# Altium schematic sheet powersupply.SchDoc: Linda 50 - Power Suply
size A4; Author: Eduardo Marques; Organization: Linda Hand Build Amplifiers
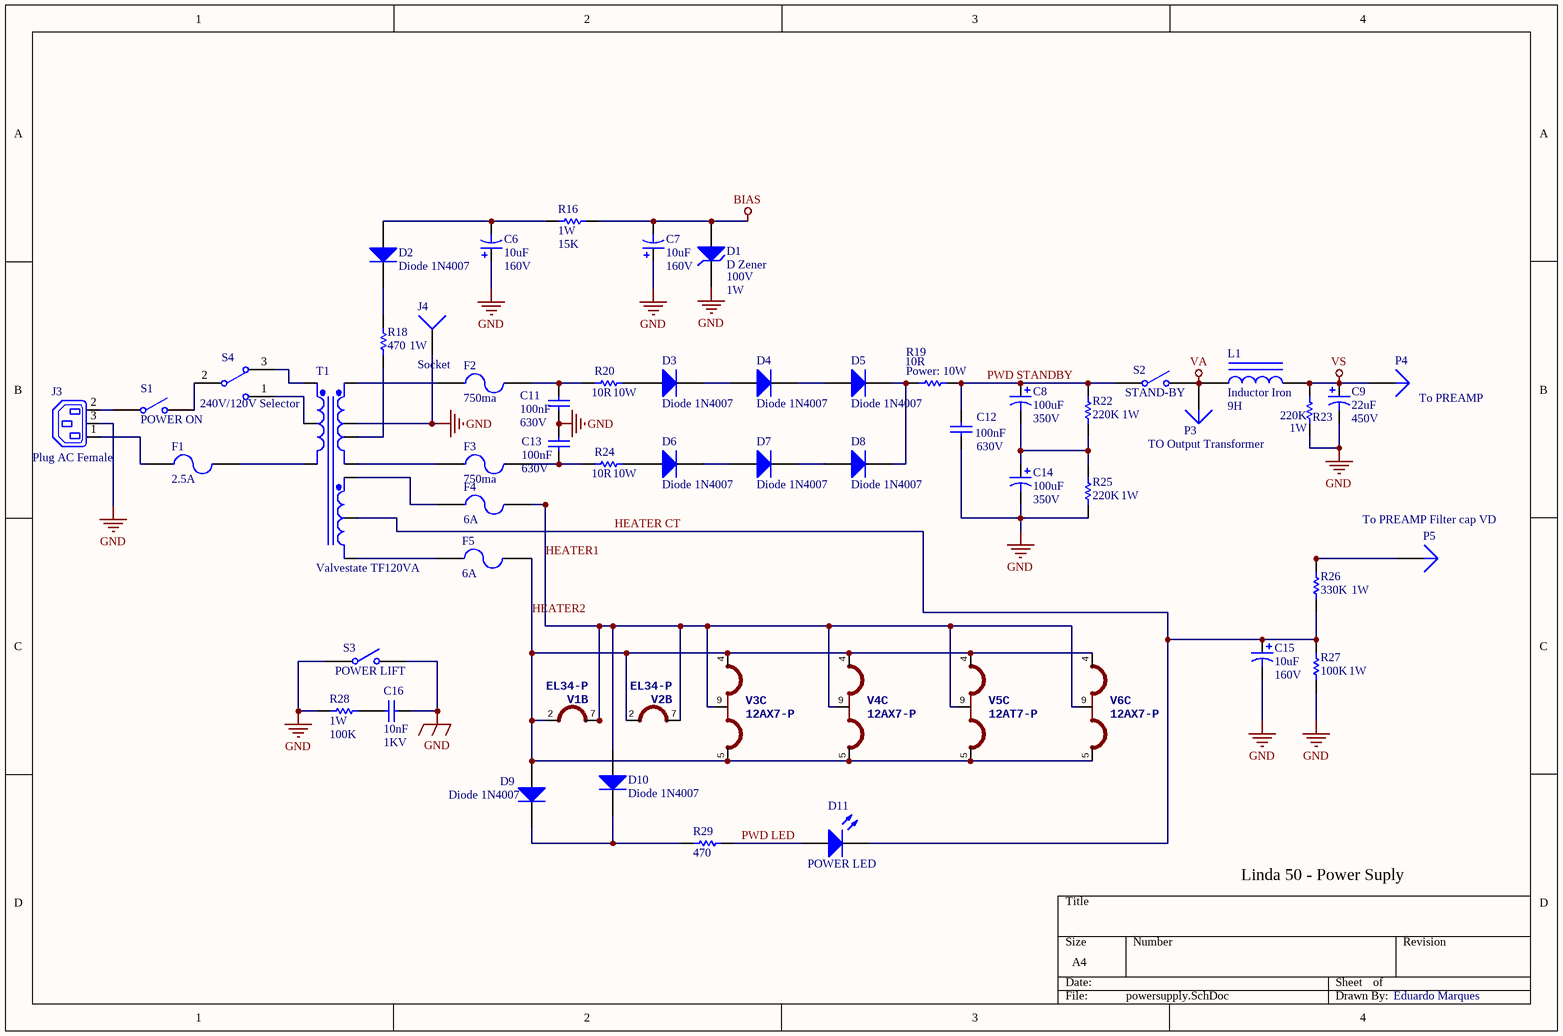
[diagram p0: powersupply.SchDoc]

## Parts
C6  value 10uF  Voltage: 160V  [RAD-POL-16x20x7.5]  (hidden comment: Cap Pol Radial Vishay 22uF 100V)
C7  value 10uF  Voltage: 160V  [RAD-POL-16x20x7.5]  (hidden comment: Cap Pol Radial Vishay 22uF 100V)
C8  value 100uF  Voltage: 350V  [FT Eletrolitic 100uF Axial]  (hidden comment: Cap FT Eletrolitic 100uF Axial 350V)
C9  value 22uF  Voltage: 450V  [RAD-POL-7.6-15]  (hidden comment: Cap Pol Rad)
C11  value 100nF  Voltage: 630V  [CAP-XICON-100nF-630V]  (hidden comment: Orange Drop Capacitor)
C12  value 100nF  Voltage: 630V  [CAP-XICON-100nF-630V]  (hidden comment: Orange Drop Capacitor)
C13  value 100nF  Voltage: 630V  [CAP-XICON-100nF-630V]  (hidden comment: Orange Drop Capacitor)
C14  value 100uF  Voltage: 350V  [FT Eletrolitic 100uF Axial]  (hidden comment: Cap FT Eletrolitic 100uF Axial 350V)
C15  value 10uF  Voltage: 160V  [RAD-POL-16x20x7.5]  (hidden comment: Cap Pol Radial Vishay 22uF 100V)
C16  value 10nF  Voltage: 1KV  [RAD-0.4]  (hidden comment: Orange Drop Capacitor)
D1  D Zener  Voltage: 100V  Power: 1W  [ZENER 1W 100V]
D2  Diode 1N4007  [1N4007-10.46mm Diode]
D3  Diode 1N4007  [1N4007-10.46mm Diode]
D4  Diode 1N4007  [1N4007-10.46mm Diode]
D5  Diode 1N4007  [1N4007-10.46mm Diode]
D6  Diode 1N4007  [1N4007-10.46mm Diode]
D7  Diode 1N4007  [1N4007-10.46mm Diode]
D8  Diode 1N4007  [1N4007-10.46mm Diode]
D9  Diode 1N4007  [1N4007-10.46mm Diode]
D10  Diode 1N4007  [1N4007-10.46mm Diode]
D11  POWER LED  [LED-1]
F1  2.5A  [PIN-W2/E2.8]
F2  750ma  [FUSE-PCB-6x31]
F3  750ma  [FUSE-PCB-6x31]
F4  6A  [FUSE-PCB-6x31]
F5  6A  [FUSE-PCB-6x31]
J3  Plug AC Female  [IEC7-2H3]
J4  Socket  [PIN1]
L1  Inductor Iron  value 9H  [AXIAL-0.9]
P3  TO Output Transformer  [PIN1]
P4  To PREAMP  [PIN1]
P5  To PREAMP Filter cap VD  [PIN1]
R16  value 15K  Power: 1W  [AXIAL-0.6]  (hidden comment: Metal Film Resistor 1W)
R18  value 470  Power: 1W  [AXIAL-0.6]  (hidden comment: Metal Film Resistor 1W)
R19  value 10R  Power: 10W  [Power Wirewound Resistor 10W - Vishay Dale]  (hidden comment: Wire Wound Power Resistor)
R20  value 10R  Power: 10W  [Power Wirewound Resistor 10W - Vishay Dale]  (hidden comment: Wire Wound Power Resistor)
R22  value 220K  Power: 1W  [RESISTOR-MetalOxide-3W]  (hidden comment: Metal Film Resistor 1W)
R23  value 220K  Power: 1W  [AXIAL-0.6]  (hidden comment: Metal Film Resistor 1W)
R24  value 10R  Power: 10W  [Power Wirewound Resistor 10W - Vishay Dale]  (hidden comment: Wire Wound Power Resistor)
R25  value 220K  Power: 1W  [RESISTOR-MetalOxide-3W]  (hidden comment: Metal Film Resistor 1W)
R26  value 330K  Power: 1W  [AXIAL-0.6]  (hidden comment: Metal Film Resistor 1W)
R27  value 100K  Power: 1W  [AXIAL-0.6]  (hidden comment: Metal Film Resistor 1W)
R28  value 100K  Power: 1W  [AXIAL-0.6]  (hidden comment: Metal Film Resistor 1W)
R29  value 470  [AXIAL-0.6]  (hidden comment: Metal Film Resistor 1/2W)
S1  POWER ON  [SPST-2]
S2  STAND-BY  [SPST-2]
S3  POWER LIFT  [SPST-2]
S4  240V/120V Selector  [SPDT]
T1  Valvestate TF120VA  [TRF_5]
V1  EL34-P  [OKTAL]  (part B of 2)
V2  EL34-P  [OKTAL]  (part B of 2)
V3  12AX7-P  [NOVAL]  (part C of 3)
V4  12AX7-P  [NOVAL]  (part C of 3)
V5  12AT7-P  [NOVAL]  (part C of 3)
V6  12AX7-P  [NOVAL]  (part C of 3)

## Nets
BIAS: C7.2 D1.1(A) R16.1
GND: C6.1 C7.1 C9.2 C11.1 C12.1 C13.2 C14.2 C15.2 C16.1 D1.2(K) J3.3(E) J4.1 R23.1 R25.1 R27.1 R28.2 S3.1(COMMON) S3.2(NO) T1.5(SEC_CT)
VA: L1.1 P3.1 S2.2(NO)
VS: C9.1 L1.2 P4.1 R23.2
HEATER1: D10.1(A) F4.2 V1.7(H2) V2.7(H2) V3.9(H2) V4.9(H2) V5.9(H2) V6.9(H2)
HEATER2: D9.1(A) F5.2 V1.2(H1) V2.2(H1) V3.4(H1) V3.5(H3) V4.4(H1) V4.5(H3) V5.4(H1) V5.5(H3) V6.4(H1) V6.5(H3)
HEATER CT: C15.1 D11.2(K) R26.1 R27.2 T1.9(3.15V_CT)
PWD LED: D11.1(A) R29.2
PWD STANDBY: C8.1 C12.2 R19.2 R22.2 S2.1(COMMON)
NetC6_2: C6.2 D2.1(A) R16.2
NetC8_2: C8.2 C14.1 R22.1 R25.2
NetC11_2: C11.2 F2.2 R20.1
NetC13_1: C13.1 F3.2 R24.1
NetC16_2: C16.2 R28.1
NetD2_2: D2.2(K) R18.2
NetD3_1: D3.1(A) R20.2
NetD3_2: D3.2(K) D4.1(A)
NetD4_2: D4.2(K) D5.1(A)
NetD5_2: D5.2(K) D8.2(K) R19.1
NetD6_1: D6.1(A) R24.2
NetD6_2: D6.2(K) D7.1(A)
NetD7_2: D7.2(K) D8.1(A)
NetD9_2: D9.2(K) D10.2(K) R29.1
NetF1_1: F1.1 J3.1(L)
NetF1_2: F1.2 T1.3(Pri-)
NetF2_1: F2.1 T1.4(Sec_355V_+)
NetF3_1: F3.1 T1.7(Sec_355V_-)
NetF4_1: F4.1 T1.8(3.15V+)
NetF5_1: F5.1 T1.10(3.15V_-)
NetJ3_2: J3.2(N) S1.1(COMMON)
NetP5_1: P5.1 R26.2
NetR18_1: R18.1 T1.6(Sec_55V_+)
NetS1_2: S1.2(NO) S4.2
NetS4_1: S4.1 T1.2(Pri+_127V)
NetS4_3: S4.3 T1.1(Pri+220V)

## Library data of the parts
C6 C7 C15 = Cap Pol Radial Vishay 22uF 100V: Vishay 22uF 100V Polarized Capacitor (Radial); 2 Leads; Part Number: 142 RHS; Published: 8-Jun-2000; LatestRevisionDate: 17-Jul-2002; LatestRevisionNote: Re-released for DXP Platform.; PackageReference: POLAR0.8; Publisher: Altium Limited; PackageDescription: Polarized Capacitor; 2 Leads
C8 C14 = Cap FT Eletrolitic 100uF Axial 350V: FT Eletrolitic Polarized Capacitor Axial 100uF; Published: 8-Jun-2000; LatestRevisionDate: 12-Feb-2014; LatestRevisionNote: Re-released for DXP Platform.; PackageReference: POLAR0.8; Publisher: Whitesheep Amps; PackageDescription: Polarized Capacitor; 2 Leads
C9 = Cap Pol Rad: Polarized Capacitor (Axial); Published: 8-Jun-2000; LatestRevisionDate: 17-Jul-2002; LatestRevisionNote: Re-released for DXP Platform.; PackageReference: POLAR0.8; Publisher: Altium Limited; PackageDescription: Polarized Capacitor; 2 Leads
C11-C13 C16 = Cap-XICON-100nF-630V: Capacitor XICON (WINE COVER) Polypropilene CAP 630V; Published: 8-Jun-2000; LatestRevisionDate: 17-Jul-2002; LatestRevisionNote: Re-released for DXP Platform.; PackageReference: RAD-0.3; Publisher: Altium Limited; PackageDescription: Radial Cap, Thru-Hole; 2 Leads; 0.3 in Pin Spacing
D1 = D Zener: Zener Diode; Model: 1N4764A; Builder: Vishay; Published: 8-Jun-2000; LatestRevisionDate: 17-Jul-2002; LatestRevisionNote: Re-released for DXP Platform.; PackageReference: DIODE-0.7; Publisher: Altium Limited; PackageDescription: Diode, Thru-Hole; 2 Leads; 0.7 in Pin Spacing
D2-D10 = Diode 1N4007: 1 Amp General Purpose Rectifier; Published: 8-Jun-2000; LatestRevisionDate: 17-Jul-2002; LatestRevisionNote: Re-released for DXP Platform.; DatasheetVersion: 1998; PackageVersion: Aug-1999; PackageReference: DO-41; Publisher: Altium Limited; PackageDescription: Diode, Axial; Body 5.2 x 2.7 mm (LxDia. max), Lead Dia. 0.86 mm (max); Code_JEDEC: DO-204-AL; ComponentLink1Description: Manufacturer Link; ComponentLink1URL: http://www.fairchildsemi.com/; ComponentLink2Description: Datasheet; ComponentLink2URL: http://www.fairchildsemi.com/ds/1N%2F1N4001.pdf
D11 = LED1: Typical RED GaAs LED; Published: 8-Jun-2000; LatestRevisionDate: 08-Jul-2005; LatestRevisionNote: Mech Layer 1 removed.; PackageReference: LED-1; Publisher: Altium Limited; PackageDescription: LED; 2 Leads
F1-F5 = Fuse 2: Fuse; Published: 8-Jun-2000; LatestRevisionDate: 17-Jul-2002; LatestRevisionNote: Re-released for DXP Platform.; PackageReference: PIN-W2/E2.8; Publisher: Altium Limited; PackageDescription: Thru-Hole; 2 Leads
J3 = Plug AC Female: IEC Mains Power Outlet, EN60 320-2-2 F Class I, PC Flange Rear Mount, Chassis Socket; PackageDocument: ver.80, 15-Sep-2003; MaximumRating: 10A, 250V a.c. (UL & CSA 15A, 250V a.c.); MountingFixtures: Not drawn on schematic symbol.; PCB_Layout: Complies with manufacturer's recommendation.; DrillSize: Corresponds to nominal value.; Published: 15-Jul-2004; LatestRevisionDate: 15-Jul-2004; LatestRevisionNote: Component Replaced & renamed from "Phonejack".; DatasheetDocument: ver.80, 15-Sep-2003; PackageReference: PX0675/PC; Publisher: Altium Limited; Terminations: P.C. Spills; ComponentLink1Description: Manufacturer Link; ComponentLink1URL: http://www.bulgin.co.uk/
L1 = Inductor Iron: Magnetic-Core Inductor; Published: 24-Mar-1999; LatestRevisionDate: 17-Jul-2002; LatestRevisionNote: Re-released for DXP Platform.; PackageReference: AXIAL-0.9; Publisher: Altium Limited; PackageDescription: Axial Device, Thru-Hole; 2 Leads; 0.9 in Pin Spacing
P3-P5 = Plug: LatestRevisionDate: 17-Jul-2002; LatestRevisionNote: Re-released for DXP Platform.; Publisher: Altium Limited
R16 R18 R22 R23 R25-R28 = Res Wire Wound 1W: Semiconductor Resistor; Published: 8-Jun-2000; LatestRevisionDate: 29-Mar-2014; LatestRevisionNote: 19-Mar-2014; PackageReference: AXIAL-0.5; Publisher: Linda Hand Buit Amplifiers; PackageDescription: Axial Device, Thru-Hole; 2 Leads; 0.5 in Pin Spacing
R19 = Res Vishay Dale Wire Wound Power Resistor 10R 10W: Semiconductor Resistor; Manufacturer Part Number: RS01010R00FE73; Published: 8-Jun-2014; LatestRevisionDate: 17-Jul-2002; LatestRevisionNote: 12-Fev-2014; PackageReference: AXIAL-1.0; Publisher: Whitesheep Amps; PackageDescription: Axial Device, Thru-Hole; 2 Leads; 0.5 in Pin Spacing
R20 R24 = Res Wire Wound Power Resistor 5W: Semiconductor Resistor; Published: 8-Jun-2014; LatestRevisionDate: 17-Jul-2002; LatestRevisionNote: 12-Fev-2014; PackageReference: AXIAL-1.0; Publisher: Whitesheep Amps; PackageDescription: Axial Device, Thru-Hole; 2 Leads; 0.5 in Pin Spacing
R29 = Res Metal Film 1/2W: Semiconductor Resistor; Published: 8-Jun-2000; LatestRevisionDate: 17-Jul-2002; LatestRevisionNote: 12-Fev-2014; PackageReference: AXIAL-0.5; Publisher: Whitesheep Amps; PackageDescription: Axial Device, Thru-Hole; 2 Leads; 0.5 in Pin Spacing; Power: 1/2W
S1-S3 = SW-SPST: Single-Pole, Single-Throw Switch; Published: 24-Mar-1999; LatestRevisionDate: 17-Jul-2002; LatestRevisionNote: Re-released for DXP Platform.; PackageReference: SPST-2; Publisher: Altium Limited; PackageDescription: Switch; 2 Leads
S4 = SW-SPDT: SPDT Subminiature Toggle Switch, Right Angle Mounting, Vertical Actuation; Published: 24-Mar-1999; LatestRevisionDate: 17-Dec-2003; LatestRevisionNote: Schematic revised, PCB Footprint replaced.; DatasheetVersion: 05-Dec-2000; PackageReference: TL36WW15050; Publisher: Altium Limited; PackageDescription: Switch; 4 Leads; ComponentLink1Description: Manufacturer Link; ComponentLink1URL: http://www.apem.com
T1 = Valvestate TF120VA: VALVESTATE TF 120VA; Published: 29-Mar-2014; LatestRevisionDate: 29-Mar-2014; LatestRevisionNote: Construção do Trafo Hammond para Bassman 5F6A; PackageReference: TRF_10; Publisher: LINDA Hand Built Amplifiers; PackageDescription: Transformer; 10Leads
J4 = Socket: LatestRevisionDate: 17-Jul-2002; LatestRevisionNote: Re-released for DXP Platform.; Publisher: Altium Limited